# EAGLE design Battery Display Board (EAGLE 8.4.1)
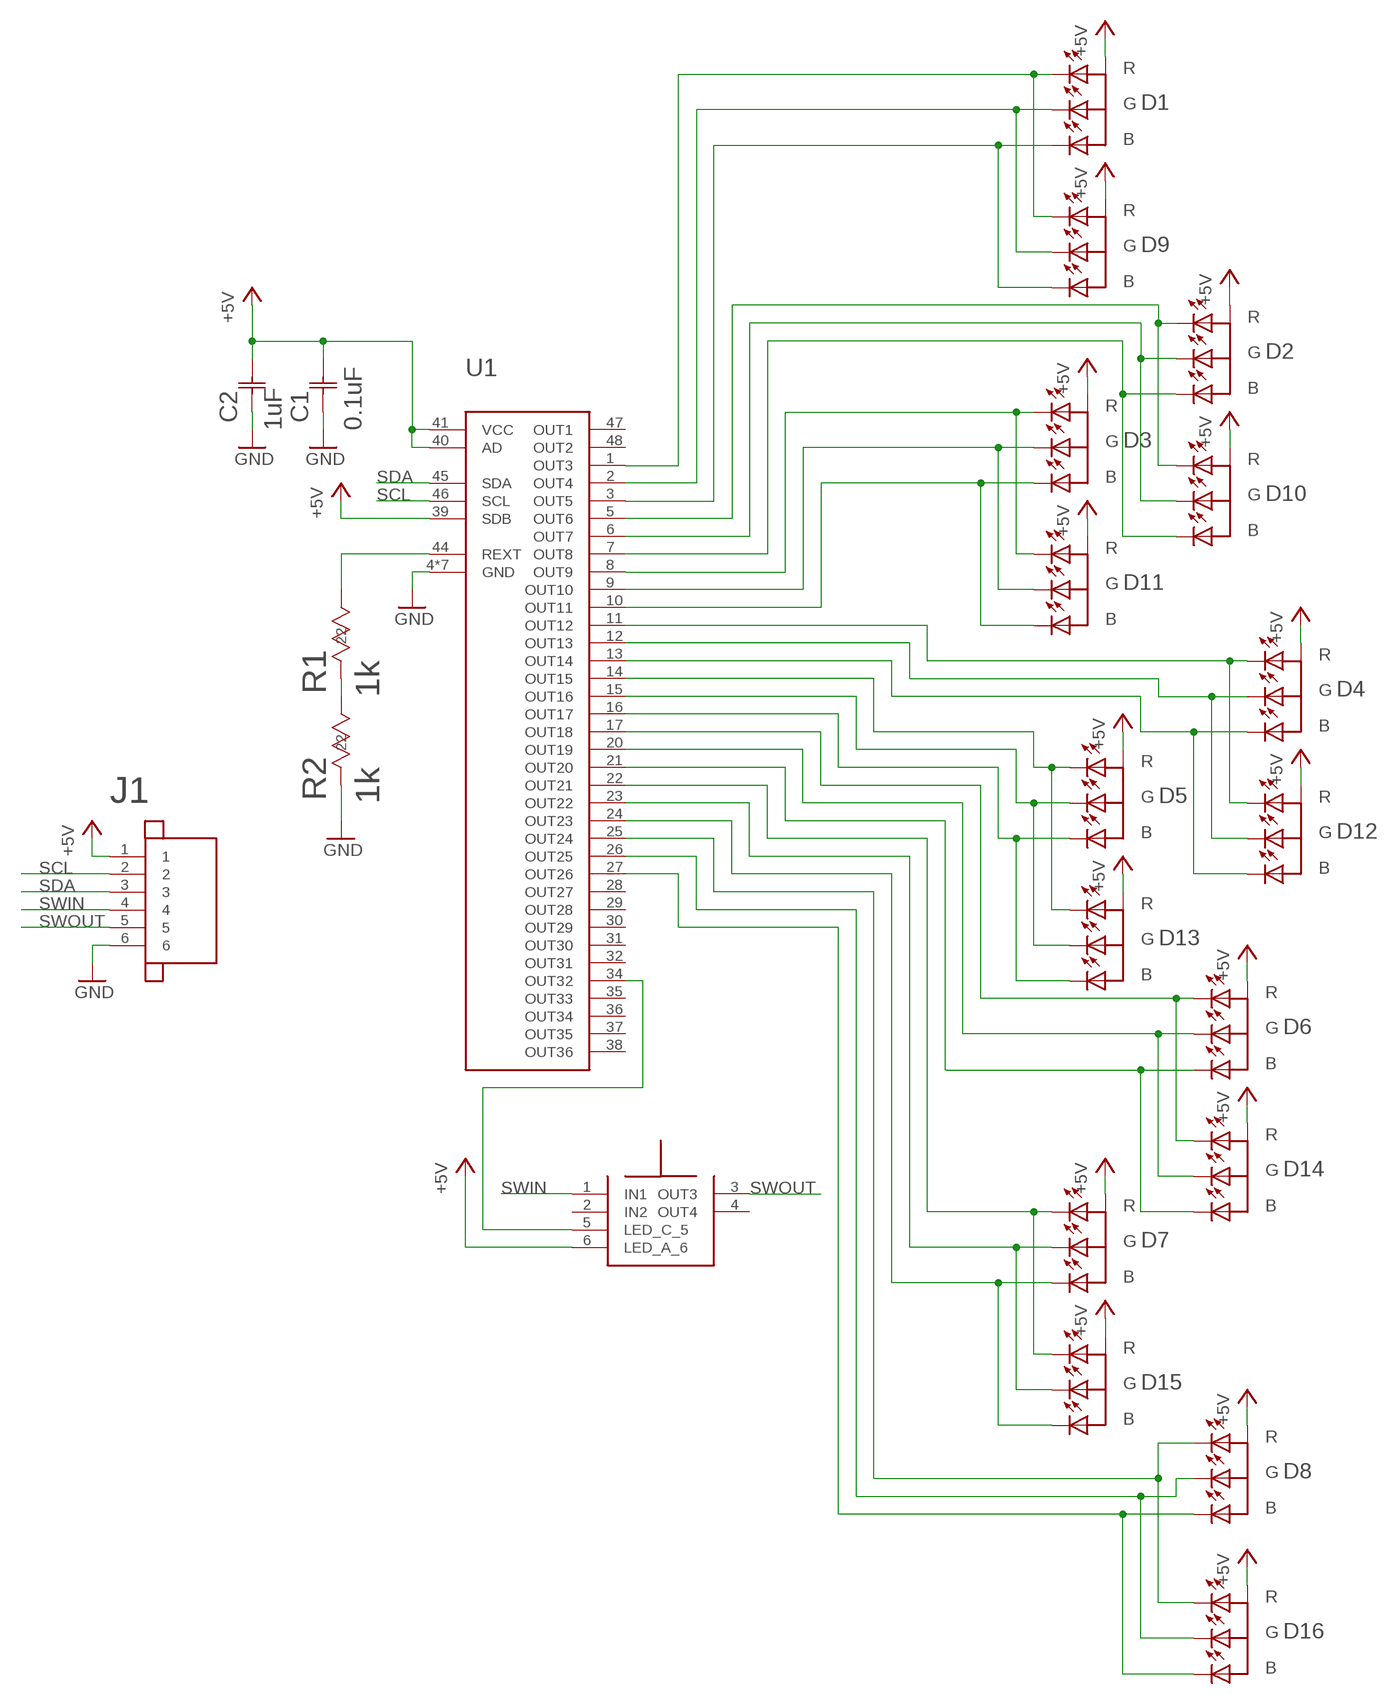
[diagram p0: schematic, sheet 1]

## Parts
C1  0.1uF  08055C104KAT2A  [0805]
C2  1uF  CC0805KKX7R7BB105  [YAG_CC0805]
D1  ASMB-MTB0-0A3A2  [ASMB-MTB0_LED]
D2  ASMB-MTB0-0A3A2  [ASMB-MTB0_LED]
D3  ASMB-MTB0-0A3A2  [ASMB-MTB0_LED]
D4  ASMB-MTB0-0A3A2  [ASMB-MTB0_LED]
D5  ASMB-MTB0-0A3A2  [ASMB-MTB0_LED]
D6  ASMB-MTB0-0A3A2  [ASMB-MTB0_LED]
D7  ASMB-MTB0-0A3A2  [ASMB-MTB0_LED]
D8  ASMB-MTB0-0A3A2  [ASMB-MTB0_LED]
D9  ASMB-MTB0-0A3A2  [ASMB-MTB0_LED]
D10  ASMB-MTB0-0A3A2  [ASMB-MTB0_LED]
D11  ASMB-MTB0-0A3A2  [ASMB-MTB0_LED]
D12  ASMB-MTB0-0A3A2  [ASMB-MTB0_LED]
D13  ASMB-MTB0-0A3A2  [ASMB-MTB0_LED]
D14  ASMB-MTB0-0A3A2  [ASMB-MTB0_LED]
D15  ASMB-MTB0-0A3A2  [ASMB-MTB0_LED]
D16  ASMB-MTB0-0A3A2  [ASMB-MTB0_LED]
J1  JST_SH_6POS_SIDE  [JST_SH_6POS_SIDE]
R1  1k  RC0603JR-071KLRC0603N-M  [RC0603N-M]
R2  1k  RC0603JR-071KLRC0603N-M  [RC0603N-M]
U1  IS31FL3236  [TQFP-48]
U$2  LED_TACT_SWITCH  [LED_TACT_SWITCH]

## Nets
+5V: C1.2 C2.2 D1.1(A) D2.1(A) D3.1(A) D4.1(A) D5.1(A) D6.1(A) D7.1(A) D8.1(A) D9.1(A) D10.1(A) D11.1(A) D12.1(A) D13.1(A) D14.1(A) D15.1(A) D16.1(A) J1.1 U1.39(SDB) U1.40(AD) U1.41(VCC) U$2.6(LED_A_6)
GND: C1.1 C2.1 J1.6 R2.2 U1.4(GND) U1.18(GND) U1.19(GND) U1.33(GND) U1.42(GND) U1.43(GND) U1.EP(GND)
N$1: D1.4(R) D9.4(R) U1.1(OUT3)
N$2: D1.3(G) D9.3(G) U1.2(OUT4)
N$3: D2.3(G) D10.3(G) U1.6(OUT7)
N$4: D1.2(B) D9.2(B) U1.3(OUT5)
N$5: D2.4(R) D10.4(R) U1.5(OUT6)
N$6: R1.1 U1.44(REXT)
N$7: D3.4(R) D11.4(R) U1.8(OUT9)
N$8: D3.3(G) D11.3(G) U1.9(OUT10)
N$9: D3.2(B) D11.2(B) U1.10(OUT11)
N$10: D4.4(R) D12.4(R) U1.11(OUT12)
N$11: D4.3(G) D12.3(G) U1.12(OUT13)
N$12: D4.2(B) D12.2(B) U1.13(OUT14)
N$13: D5.4(R) D13.4(R) U1.14(OUT15)
N$14: D5.3(G) D13.3(G) U1.15(OUT16)
N$15: D5.2(B) D13.2(B) U1.16(OUT17)
N$16: D6.4(R) D14.4(R) U1.17(OUT18)
N$17: D6.3(G) D14.3(G) U1.20(OUT19)
N$18: D6.2(B) D14.2(B) U1.21(OUT20)
N$19: D7.4(R) D15.4(R) U1.22(OUT21)
N$20: D7.3(G) D15.3(G) U1.23(OUT22)
N$21: D7.2(B) D15.2(B) U1.24(OUT23)
N$22: D8.4(R) D16.4(R) U1.25(OUT24)
N$23: D8.3(G) D16.3(G) U1.26(OUT25)
N$24: D8.2(B) D16.2(B) U1.27(OUT26)
N$25: D2.2(B) D10.2(B) U1.7(OUT8)
N$26: R1.2 R2.1
N$27: U1.34(OUT32) U$2.5(LED_C_5)
SCL: J1.2 U1.46(SCL)
SDA: J1.3 U1.45(SDA)
SWIN: J1.4 U$2.1(IN1)
SWOUT: J1.5 U$2.3(OUT3)
Unconnected: U1.28(OUT27) U1.29(OUT28) U1.30(OUT29) U1.31(OUT30) U1.32(OUT31) U1.35(OUT33) U1.36(OUT34) U1.37(OUT35) U1.38(OUT36) U1.47(OUT1) U1.48(OUT2) U$2.2(IN2) U$2.4(OUT4)

## Library data of the parts
C1 = 0.1uF X7R Ceramic Capacitor:08055C104KAT2A; COPYRIGHT: Copyright C 2015 Accelerated Designs. All rights reserved; MANUFACTURER_PART_NUMBER: 08055C104KAT2A; VENDOR: Vendor
C2 = 1uF X7R Ceramic Capacitor:CC0805KKX7R7BB105; COPYRIGHT: Copyright C 2015 Accelerated Designs. All rights reserved; MANUFACTURER_PART_NUMBER: CC0805KKX7R7BB105; VENDOR: Vendor
D1-D16 = thanics_robotics:ASMB-MTB0-0A3A2
J1 = thanics_robotics:JST_SH_6POS_SIDE
R1 R2 = 1k-resistor:RC0603JR-071KL; CASE: 0603 1608 metric; COMPOSITION: Thick Film; COPYRIGHT: Copyright C 2015 Accelerated Designs. All rights reserved; DATASHEET: httpwww.yageo.comdocumentsrecentPYuRC0603_51_RoHS_L_4.pdf; DESCRIPTION: RES 1.0K OHM 110W 5% 0603 SMD; DIGIKEYPARTNUMBER: 3111.0KGRTRND; HEIGHT: 0.022" 0.55mm; LEADSTYLE: Surface Mount SMD SMT; MANUFACTURER_PART_NUMBER: RC0603JR071KL; NEWARKPARTNUMBER: 14M7231; NUMBEROFTERMINATIONS: 2; PACKAGECASE: 0603 1608 Metric; PACKAGING: Tape &amp Reel TR; POWERWATTS: 0.1W 110W; QUANTITY_AVAILABLE: 0; RESISTANCEINOHMS: 1.00K; RESISTANCEOHMS: 1K; SIZEDIMENSION: 0.063" L x 0.031" W 1.60mm x 0.80mm; TEMPERATURECOEFFICIENT: 100ppm°C; TOLERANCE: 5%; VENDOR: Yageo; VOLTAGEWORKING: 50V
U1 = thanics_robotics:IS31FL3236
U$2 = thanics_robotics:LED_TACT_SWITCH

## Board
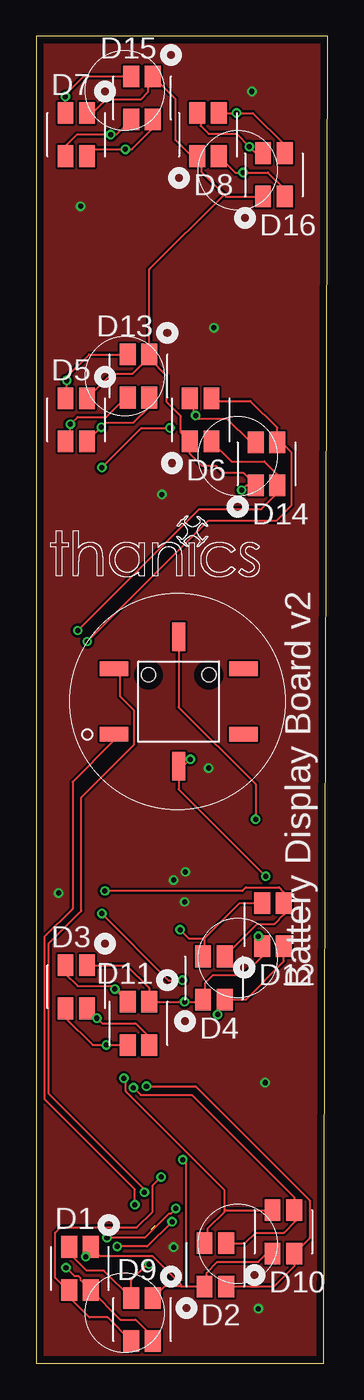
[diagram p1: board, top side]
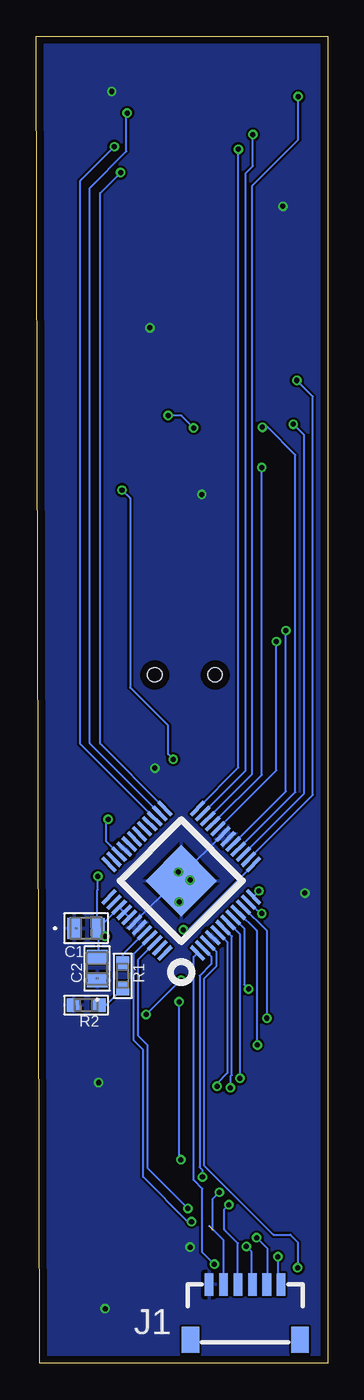
[diagram p2: board, bottom side, seen from below]

Size 20.24 x 92.19 mm. Coordinates in mm from the lower left corner, seen from the top.
Outline: 0,0 19.99,0 20.24,92.19 0,92.19 0,0
Copper layers (1*16): Top 0.035mm / dielectric 1.6mm / Bottom 0.035mm
Design rules "Elecrow_2-layer_PCB_eagle_rule": minimum track width 6mil, minimum drill 12mil, track to track 6mil, track to pad 6mil, pad to pad 6mil, via to via 8mil, smd to smd 0mil, copper to edge 20mil, drill to drill 10mil, minimum pad ring 6mil, minimum via ring 6mil, stop-mask expansion 0mil, vias tented up to drill 100mil, thermal gap 10mil

### Footprints (pad centres in the part's own frame; a part is rotated, then mirrored left to right if it is on the bottom)
0805 = smd 0.965 x 1.448: 1 -0.826,0; 2 0.826,0
YAG_CC0805 = smd 0.965 x 1.448: 1 -0.826,0; 2 0.826,0
ASMB-MTB0_LED = smd 1.1 x 1.5: 1 -0.75,-1.5; 2 -0.75,1.5; 3 0.75,1.5; 4 0.75,-1.5
JST_SH_6POS_SIDE = smd 0.6 x 1.55: 1 -1.5,0; 2 -0.5,0; 3 0.5,0; 4 1.5,0; 5 2.5,0; 6 3.5,0 | smd 1.2 x 1.8: P$5 -2.8,3.85; P$6 4.8,3.85
RC0603N-M = smd 0.965 x 0.914: 1 -0.876,0; 2 0.876,0
TQFP-48 = smd 1.3 x 0.25: 1 -4.35,2.75; 2 -4.35,2.25; 3 -4.35,1.75; 4 -4.35,1.25; 5 -4.35,0.75; 6 -4.35,0.25; 7 -4.35,-0.25; 8 -4.35,-0.75; 9 -4.35,-1.25; 10 -4.35,-1.75; 11 -4.35,-2.25; 12 -4.35,-2.75; 25 4.35,-2.75; 26 4.35,-2.25; 27 4.35,-1.75; 28 4.35,-1.25; 29 4.35,-0.75; 30 4.35,-0.25; 31 4.35,0.25; 32 4.35,0.75; 33 4.35,1.25; 34 4.35,1.75; 35 4.35,2.25; 36 4.35,2.75 | smd 0.25 x 1.3: 13 -2.75,-4.35; 14 -2.25,-4.35; 15 -1.75,-4.35; 16 -1.25,-4.35; 17 -0.75,-4.35; 18 -0.25,-4.35; 19 0.25,-4.35; 20 0.75,-4.35; 21 1.25,-4.35; 22 1.75,-4.35; 23 2.25,-4.35; 24 2.75,-4.35; 37 2.75,4.35; 38 2.25,4.35; 39 1.75,4.35; 40 1.25,4.35; 41 0.75,4.35; 42 0.25,4.35; 43 -0.25,4.35; 44 -0.75,4.35; 45 -1.25,4.35; 46 -1.75,4.35; 47 -2.25,4.35; 48 -2.75,4.35 | smd 3.5 x 3.5: EP 0,0
LED_TACT_SWITCH = smd 1.999 x 1.001: 1 4.496,2.261; 2 -4.496,2.261; 3 4.496,-2.261; 4 -4.496,-2.261 | smd 0.889 x 1.999: 5 0,-4.496; 6 0,4.496 | hole 0.991: -2.095,-1.854; 2.095,-1.854

### Placement (x,y rotation side)
C1  16.76,30.23 0 bottom
C2  16,27.43 90 bottom
D1  3.05,6.6 180 top
D2  12.45,6.86 0 top
D3  2.79,26.16 180 top
D4  12.34,26.77 0 top
D5  2.79,65.53 180 top
D6  11.43,65.53 0 top
D7  2.79,85.34 180 top
D8  11.94,85.34 0 top
D9  7.37,3.05 180 top
D10  17.17,9.14 0 top
D11  7.11,23.62 180 top
D12  16.46,30.48 0 top
D13  7.11,68.58 180 top
D14  16,62.48 0 top
D15  7.37,87.88 180 top
D16  16.51,82.55 0 top
J1  4.72,5.49 180 bottom
R1  14.22,26.92 270 bottom
R2  16.76,24.89 180 bottom
U1  10.16,33.53 135 bottom
U$2  9.91,45.97 180 top

### Tracks (layer width: path | path; a pad name or v marks a point on that pad's centre or on a via)
+5V  (via drill 0.35)
  Top 0.152: D9.1 8.93,5.36 10.06,5.36 | 10.06,5.36 10.41,5.36 | 10.41,5.36 D2.1 11.84,5.5 11.84,6.3 12.6,7.06 15.44,7.06 16.03,7.64 D10.1 | D3.1 6.27,27.66 7.86,26.07 D11.1 v10.31,25.12 11.45,25.12 D4.1 11.73,25.41 11.73,26.42 12.29,26.97 14.43,26.97 15.71,28.26 D12.1 15.44,29.25 v15.44,29.67 | 10.06,5.36 10.06,5.49 8.08,7.47 4.43,7.47 D1.1 3.8,7.76 v3.45,7.42 | 10.41,5.36 10.41,13.92 v10.19,14.15 | v15.95,33.83 9.91,39.88 U$2.6 10.19,41.48 v10.72,41.96 | D7.1 3.89,86.84 4.83,87.78 7.26,87.78 7.77,88.29 7.77,89.04 D15.1 9.65,87.85 9.65,84.99 10.8,83.84 D8.1 11.48,83.55 11.48,82.75 13.06,81.18 | 13.06,81.18 13.18,81.05 D16.1 | D5.1 5.24,68.73 6.71,68.73 7.86,69.89 D13.1 | D13.1 7.86,70.41 7.86,75.98 13.06,81.18 | D13.1 7.86,69.81 9.09,68.58 9.09,66.75 10.06,65.79 10.06,64.65 D6.1 10.68,63.18 11.53,62.33 12.5,62.33 13.01,61.82 14.41,61.82 D14.1 14.6,60.98 v14.28,60.66
  Bottom 0.152: v10.19,14.15 10.31,14.28 v10.31,25.12 | v15.44,29.67 15.94,30.16 C1.2 | C1.2 15.94,28.32 C2.2 | C1.2 U1.39 U1.40 | U1.40 | U1.40 U1.41 | C1.2 16,30.29 16,32.87 15.95,32.92 v15.95,33.83 | v3.45,7.42 3.45,6.35 3.25,6.15 3.25,5.51 J1.1 | v14.28,60.66 13.72,60.1 13.72,46.94 11.07,44.3 11.07,42.32 v10.72,41.96
GND  (via drill 0.35)
  Bottom 0.152: U1.19 10.16,33.88 U1.EP 10.51,33.53 U1.42
  other vias: 10.36,34.14 9.55,33.58 10.31,32.05 11.99,41.35 8.74,60.35 12.34,71.93 3.1,80.37 14.99,88.34 1.57,32.66 15.9,19.51 15.44,3.81 9.55,8.08
  pour Bottom: 0,92.2 20.32,92.2 20.07,0 0,0
  pour Top: 0,92.2 20.07,92.2 20.07,0 0,0
N$1  (via drill 0.35)
  Top 0.152: D1.4 2.3,7.66 3.5,6.45 4.71,6.45 D9.4 6.62,5.8 7.71,6.9 v7.86,6.9
  Bottom 0.152: U1.1 9.3,28.24 9.3,12.75 8.69,12.14 8.69,7.72 v7.86,6.9
N$2  (via drill 0.35)
  Top 0.152: D9.3 4.96,3.2 3.71,3.2 2.3,4.61 2.3,5.03 | 2.3,5.03 D1.3 | 2.3,5.03 2.23,5.03 1.32,5.94 1.32,9.09 1.68,9.45 7.01,9.45 8.08,10.52 8.08,12.34 v8.69,12.95
  Bottom 0.152: U1.2 8.08,28.26 8.08,27.74 8.89,26.92 8.89,13.64 8.69,13.44 v8.69,12.95
N$3  (via drill 0.35)
  Top 0.152: D2.3 14.51,8.36 15.24,9.09 17.22,9.09 18.03,9.91 18.03,10.53 D10.3 17.92,11.54 10.82,18.64 7.26,18.64 v6.76,19.15
  Bottom 0.152: v6.76,19.15 6.76,19.94 6.66,20.04 6.66,29.67 U1.6
N$4  (via drill 0.35)
  Top 0.152: D9.2 8.12,1.84 6.91,3.05 5.85,3.05 D1.2 3.08,5.82 3.08,5.95 2.94,6.08 2.65,6.08 v2.08,6.65
  Bottom 0.152: U1.3 7.72,28.61 7.72,27.58 8.59,26.72 8.59,13.77 3.76,8.94 2.59,8.94 2.08,8.43 v2.08,6.65
N$5  (via drill 0.35)
  Top 0.152: D2.4 16.53,5.36 17.92,6.74 17.92,7.62 | 17.92,7.62 D10.4 | v7.67,19.25 11.07,19.25 19,11.33 19,8.7 17.92,7.62
  Bottom 0.152: U1.5 6.96,29.27 6.96,20.17 7.67,19.46 v7.67,19.25
N$6
  Bottom 0.152: U1.44 14.22,28.4 R1.1
N$7  (via drill 0.35)
  Top 0.152: D3.4 2.04,27.06 2.9,26.21 5.27,26.21 v5.48,26 D11.4
  Bottom 0.152: v5.48,26 5.79,26.31 5.79,30.22 U1.8
N$8  (via drill 0.35)
  Top 0.152: D3.3 2.04,24.02 3.94,22.12 v4.88,22.12 D11.3
  Bottom 0.152: v4.88,22.12 4.92,22.17 4.92,30.06 U1.9
N$9  (via drill 0.35)
  Top 0.152: D3.2 v4.22,23.98 4.58,23.62 6.91,23.62 7.86,22.67 D11.2
  Bottom 0.152: U1.10 4.22,30.07 v4.22,23.98
N$10  (via drill 0.35)
  Top 0.152: D12.4 17.21,27.93 14.58,25.3 13.12,25.3 D4.4 12.6,24.78 v12.6,24.23 | v4.57,31.24 9.2,26.62 v10.16,26.62
  Bottom 0.152: U1.11 4.69,31.24 v4.57,31.24 | v10.16,26.62 10.21,26.62 v12.6,24.23
N$11  (via drill 0.35)
  Top 0.152: D4.3 15.35,30.53 16.56,30.53 17.21,31.18 D12.3 17.17,32.02 17.17,32.77 16.87,33.06 14.57,33.06 14.33,32.82 v4.78,32.82
  Bottom 0.152: U1.12 5.14,32.45 v4.78,32.82
N$12  (via drill 0.35)
  Top 0.152: D4.2 11.68,28.36 11.68,29.51 | 11.68,29.51 14.15,31.98 D12.2 | v10.01,30.12 10.62,29.51 11.68,29.51
  Bottom 0.152: U1.13 9.68,30.12 v10.01,30.12
N$13  (via drill 0.35)
  Top 0.152: D5.4 2.13,67.12 v2.13,68.27 2.13,68.53 3.68,70.08 D13.4
  Bottom 0.152: U1.14 1.02,39.49 1.02,67.16 v2.13,68.27
N$14  (via drill 0.35)
  Top 0.152: D5.3 2.39,64.38 v2.39,65.23 2.9,65.73 4.88,65.73 6.22,67.08 D13.3
  Bottom 0.152: U1.15 1.63,39.59 1.63,64.46 v2.39,65.23
N$15  (via drill 0.35)
  Top 0.152: D5.2 v4.53,65.02 4.84,65.33 6.76,65.33 7.86,66.43 D13.2
  Bottom 0.152: U1.16 2.23,39.69 2.23,63.09 4.16,65.02 v4.53,65.02
N$16  (via drill 0.35)
  Top 0.152: D6.4 13.58,62.64 15.85,62.64 16.75,61.73 D14.4 16.75,60.44 15.65,59.33 11.33,59.33 v2.9,50.9
  Bottom 0.152: U1.17 2.9,39.73 v2.9,50.9
N$17  (via drill 0.35)
  Top 0.152: D6.3 12.36,66.85 14.88,66.85 16.75,64.98 16.75,64.26 | 16.75,64.26 D14.3 | v3.56,50.14 11.94,58.52 16.66,58.52 17.73,59.59 17.73,63.28 16.75,64.26
  Bottom 0.152: U1.20 3.56,41.19 v3.56,50.14
N$18  (via drill 0.35)
  Top 0.152: D6.2 10.92,66.79 10.92,65.99 v11.07,65.84 11.28,65.63 13.26,65.63 14.91,63.98 D14.2 | v4.57,62.23 7.32,64.97 v9.3,64.97
  Bottom 0.152: U1.21 4.57,40.88 v4.57,62.23 | v9.3,64.97 10.16,65.84 v11.07,65.84
N$19  (via drill 0.35)
  Top 0.152: D7.4 v2.04,87.99 2.04,88.1 3.33,89.38 D15.4
  Bottom 0.152: U1.22 5.23,40.93 5.23,81.79 2.04,84.98 v2.04,87.99
N$20  (via drill 0.35)
  Top 0.152: D15.3 5.58,85.34 v5.18,85.34 2.85,85.34 2.04,84.54 D7.3
  Bottom 0.152: U1.23 5.69,41.18 5.69,82.65 5.18,83.16 v5.18,85.34
N$21  (via drill 0.35)
  Top 0.152: D7.2 4.03,84.33 v6.2,84.33 6.66,84.33 8.12,85.79 D15.2
  Bottom 0.152: U1.24 6.2,41.38 v6.2,84.33
N$22  (via drill 0.35)
  Top 0.152: D8.4 13.83,82.7 v14.38,82.7 16.1,82.7 17.26,81.55 D16.4
  Bottom 0.152: U1.25 15.8,43.06 15.8,81.28 v14.38,82.7
N$23  (via drill 0.35)
  Top 0.152: D8.3 v13.92,86.84 15.06,86.84 17.26,84.64 D16.3
  Bottom 0.152: U1.26 16.51,43.06 16.51,81.64 13.97,84.18 13.97,86.79 v13.92,86.84
N$24  (via drill 0.35)
  Top 0.152: D8.2 11.43,86.6 11.43,85.95 11.99,85.39 13.92,85.39 v14.81,84.51 15.26,84.05 D16.2
  Bottom 0.152: U1.27 17.17,43.01 17.17,82.14 v14.81,84.51
N$25  (via drill 0.35)
  Top 0.152: D2.2 11.94,8.6 11.94,9.4 13.06,10.52 | 13.06,10.52 13.18,10.64 D10.2 | v6.1,19.81 6.2,19.71 6.2,18.92 13.06,12.07 13.06,10.52
  Bottom 0.152: U1.7 6.1,29.82 v6.1,19.81
N$26
  Bottom 0.152: R1.2 15.38,24.89 R2.1
N$27  (via drill 0.35)
  Top 0.152: U$2.5 9.91,45.57 15.24,40.23 v15.24,37.8
  Bottom 0.152: U1.34 15.36,36.25 15.36,37.67 v15.24,37.8
SCL  (via drill 0.35)
  Top 0.152: v9.7,10.77 9.34,10.41 9.22,10.41 7.54,8.74 v4.93,8.74
  Bottom 0.152: v9.7,10.77 12.5,13.56 12.5,22.1 13.16,22.76 13.16,28.06 U1.46 | v4.93,8.74 4.2,8.01 4.2,5.51 J1.2
SDA  (via drill 0.35)
  Top 0.152: v9.45,9.86 7.72,8.13 v5.64,8.13
  Bottom 0.152: U1.45 13.46,28.46 13.46,22.45 12.8,21.79 12.8,12.95 9.7,9.86 v9.45,9.86 | v5.64,8.13 5.31,7.8 5.31,5.57 J1.3
SWIN  (via drill 0.35)
  Top 0.152: U$2.1 5.41,43.26 2.54,40.39 2.54,31.57 0.58,29.62 0.58,18.37 6.86,12.09 v6.86,11.02
  Bottom 0.152: J1.4 6.22,8.36 7.16,9.3 7.16,10.72 v6.86,11.02
SWOUT  (via drill 0.35)  (1 unrouted)
  Top 0.152: v7.52,11.89 7.52,12.09 0.89,18.72 0.89,29.18 3.15,31.44 3.15,39.32 6.81,42.98 6.81,45.36 5.84,46.33 5.84,47.8 U$2.3
  Bottom 0.152: J1.5 7.22,8.54 8.23,9.55 | 7.98,9.3 7.98,11.43 v7.52,11.89

### Text on the board
bPlace: J1
tNames: Battery Display Board v2